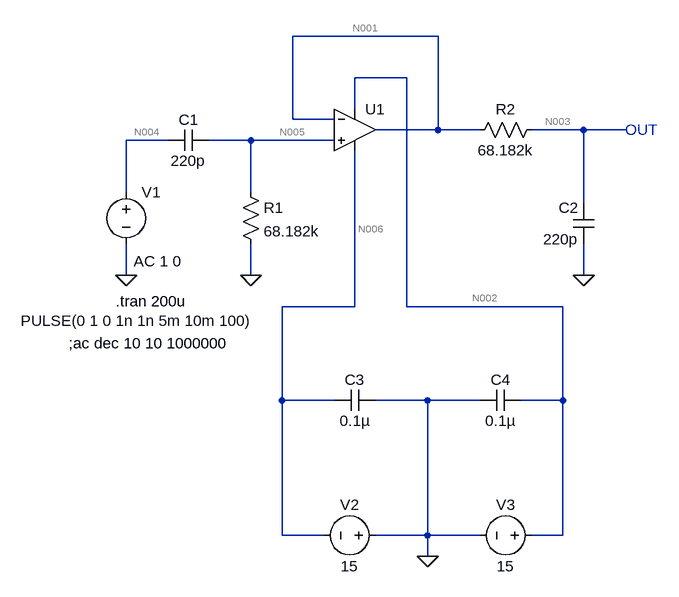
[diagram p0: schematic 2.asc]
2.asc, the LTspice schematic file:
Version 4
SHEET 1 880 864
WIRE 480 -96 256 -96
WIRE 432 -32 352 -32
WIRE 352 16 352 -32
WIRE 256 32 256 -96
WIRE 320 32 256 32
WIRE 480 48 480 -96
WIRE 480 48 384 48
WIRE 544 48 480 48
WIRE 704 48 624 48
WIRE 768 48 704 48
WIRE 64 64 0 64
WIRE 192 64 128 64
WIRE 320 64 192 64
WIRE 0 144 0 64
WIRE 192 144 192 64
WIRE 704 160 704 48
WIRE 0 272 0 224
WIRE 192 272 192 224
WIRE 704 272 704 224
WIRE 352 320 352 80
WIRE 352 320 240 320
WIRE 432 320 432 -32
WIRE 672 320 432 320
WIRE 240 464 240 320
WIRE 320 464 240 464
WIRE 464 464 384 464
WIRE 544 464 464 464
WIRE 672 464 672 320
WIRE 672 464 608 464
WIRE 240 672 240 464
WIRE 304 672 240 672
WIRE 464 672 464 464
WIRE 464 672 384 672
WIRE 544 672 464 672
WIRE 672 672 672 464
WIRE 672 672 624 672
WIRE 464 704 464 672
FLAG 464 704 0
FLAG 0 272 0
FLAG 192 272 0
FLAG 704 272 0
SYMBOL voltage 0 128 R0
WINDOW 3 -162 214 Left 2
WINDOW 123 12 122 Left 2
WINDOW 39 0 0 Left 0
SYMATTR Value PULSE(0 1 0 1n 1n 5m 10m 100)
SYMATTR Value2 AC 1 0
SYMATTR InstName V1
SYMBOL cap 128 48 R90
WINDOW 0 0 32 VBottom 2
WINDOW 3 32 32 VTop 2
SYMATTR InstName C1
SYMATTR Value 220p
SYMBOL cap 720 224 R180
WINDOW 0 24 56 Left 2
WINDOW 3 24 8 Left 2
SYMATTR InstName C2
SYMATTR Value 220p
SYMBOL res 176 128 R0
SYMATTR InstName R1
SYMATTR Value 68.182k
SYMBOL res 640 32 R90
WINDOW 0 0 56 VBottom 2
WINDOW 3 32 56 VTop 2
SYMATTR InstName R2
SYMATTR Value 68.182k
SYMBOL Opamps\\UniversalOpamp2 352 48 R0
SYMATTR InstName U1
SYMATTR Value2 Avol=0.1Meg GBW=4Meg Slew=13Meg
SYMATTR SpiceLine2 en=0 enk=0 in=0 ink=0 Rin=1T
SYMBOL cap 384 448 R90
WINDOW 0 0 32 VBottom 2
WINDOW 3 32 32 VTop 2
SYMATTR InstName C3
SYMATTR Value 0.1µ
SYMBOL voltage 400 672 R90
WINDOW 0 -32 56 VBottom 2
WINDOW 3 32 56 VTop 2
WINDOW 123 0 0 Left 0
WINDOW 39 0 0 Left 0
SYMATTR InstName V2
SYMATTR Value 15
SYMBOL voltage 640 672 R90
WINDOW 0 -32 56 VBottom 2
WINDOW 3 32 56 VTop 2
WINDOW 123 0 0 Left 0
WINDOW 39 0 0 Left 0
SYMATTR InstName V3
SYMATTR Value 15
SYMBOL cap 608 448 R90
WINDOW 0 0 32 VBottom 2
WINDOW 3 32 32 VTop 2
SYMATTR InstName C4
SYMATTR Value 0.1µ
TEXT -16 312 Left 2 !.tran 200u
TEXT 768 48 Left 2 ;OUT
TEXT -88 376 Left 2 !;ac dec 10 10 1000000

The netlist it stands for:
* 2.asc
V1 N004 0 PULSE(0 1 0 1n 1n 5m 10m 100) AC 1 0
C1 N005 N004 220p
C2 0 N003 220p
R1 N005 0 68.182k
R2 N003 N001 68.182k
XU1 N005 N001 N002 N006 N001 level.2 Avol=0.1Meg GBW=4Meg Slew=13Meg ilimit=25m rail=0 Vos=0 phimargin=45 en=0 enk=0 in=0 ink=0 Rin=1T  ; pins IN+ IN- V+ V- OUT
C3 0 N006 0.1µ
V2 0 N006 15
V3 N002 0 15
C4 N002 0 0.1µ
.tran 200u
* OUT
;ac dec 10 10 1000000
.lib UniversalOpamps2.sub
.backanno
.end

* Results of the author's LTspice run, read from the files saved beside the schematic
* Operating Point, zero values left out:
*   V(n004) = -117 µV
*   V(n002) = 15 V
*   V(n006) = -15 V
*   I(V3) = -1.498 mA
*   I(V2) = -1.498 mA
*   Ix(u1:3) = 1.498 mA
*   Ix(u1:4) = -1.498 mA
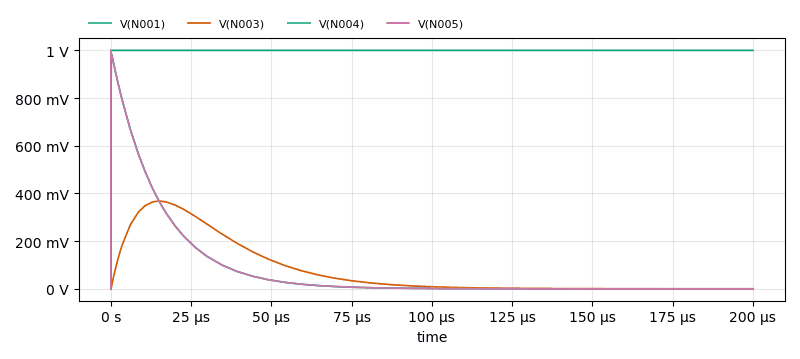
[diagram p1: Transient Analysis of 2.asc, plotted from the saved traces]
* Transient Analysis, 1 run:
*   V(N001): min 0 V, max 981.5 mV, average 75.11 mV, rms 193.6 mV, last 1.624 µV
*   V(N003): min 0 V, max 367.5 mV, average 74.93 mV, rms 136.9 mV, last 21.64 µV
*   V(N004): min 0 V, max 1 V, average 1 V, rms 1 V, last 1 V
*   V(N005): min 0 V, max 1 V, average 75.2 mV, rms 194.2 mV, last 1.619 µV